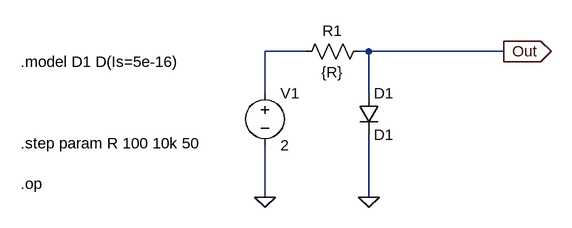
[diagram p0: schematic schematic.asc]
schematic.asc, the LTspice schematic file:
Version 4.1
SHEET 1 880 680
WIRE 64 64 0 64
WIRE 160 64 144 64
WIRE 368 64 160 64
WIRE 0 128 0 64
WIRE 160 128 160 64
WIRE 0 288 0 208
WIRE 160 288 160 192
FLAG 0 288 0
FLAG 160 288 0
FLAG 368 64 Out
IOPIN 368 64 Out
SYMBOL diode 144 128 R0
SYMATTR InstName D1
SYMATTR Value D1
SYMBOL voltage 0 112 R0
SYMATTR InstName V1
SYMATTR Value 2
SYMBOL res 160 48 R90
WINDOW 0 0 56 VBottom 2
WINDOW 3 32 56 VTop 2
SYMATTR InstName R1
SYMATTR Value {R}
TEXT -376 80 Left 2 !.model D1 D(Is=5e-16)\n \n \n \n.step param R 100 10k 50\n \n.op

The netlist it stands for:
* schematic.asc
D1 Out 0 D1
V1 N001 0 2
R1 Out N001 {R}
.model D D
.lib standard.dio
.model D1 D(Is=5e-16)
.step param R 100 10k 50
.op
.backanno
.end

* Results of the author's LTspice run, read from the files saved beside the schematic
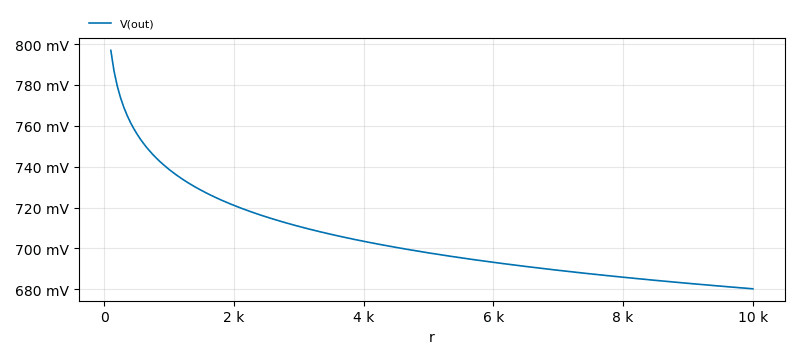
[diagram p1: Operating Point of schematic.asc, plotted from the saved traces]
* Operating Point, 1 run:
*   V(out): 796.9 mV at r=100 , 680.2 mV at r=10 k, min 680.2 mV, max 796.9 mV